# EAGLE design Grove - 3-Axis Digital Compass v1.2 (EAGLE 6.3)
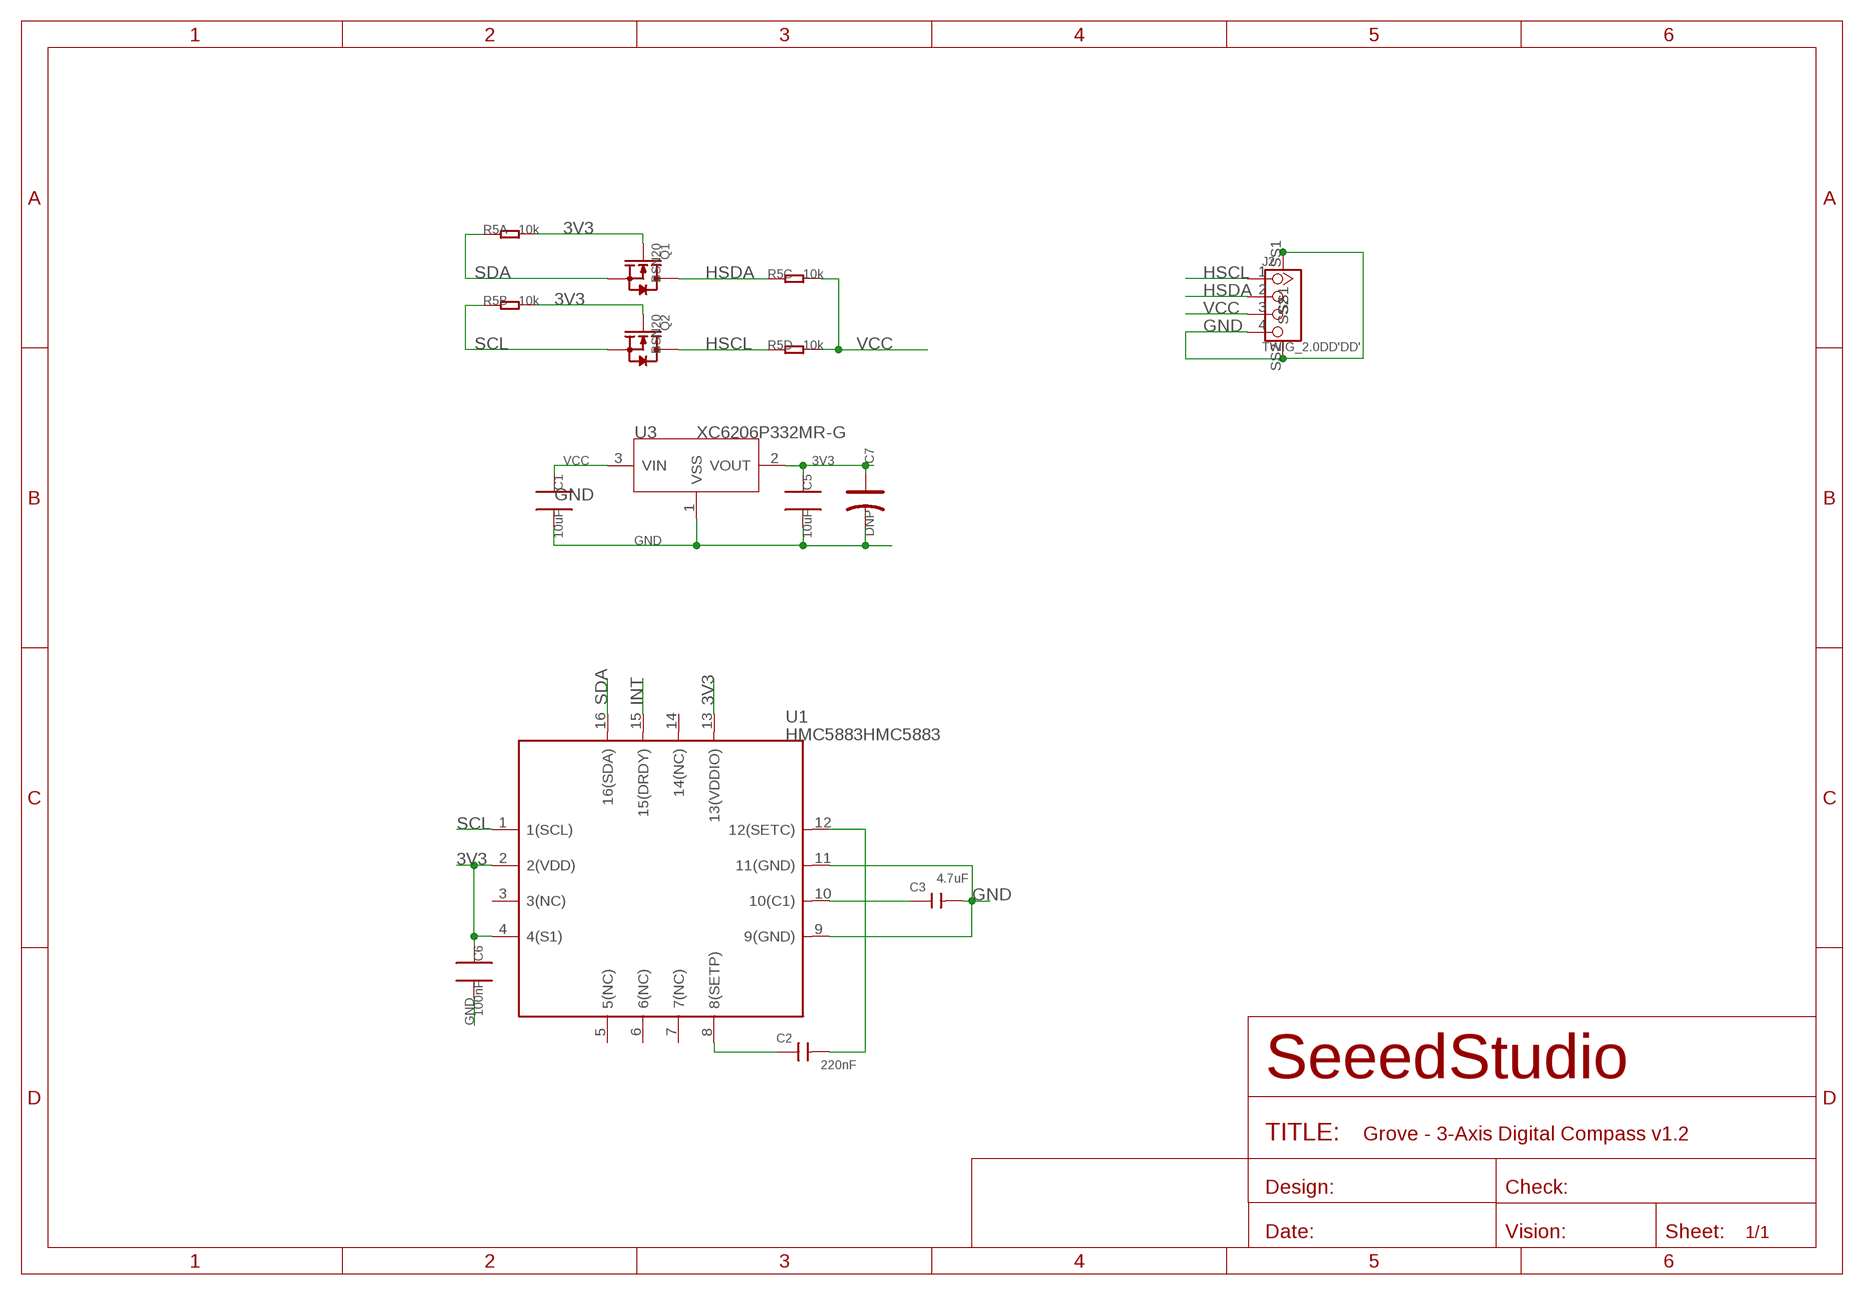
[diagram p0: schematic, sheet 1]

## Parts
C1  10uF  C0805_S  [0805_S]
C2  220nF  006-C30*35  [0603_S]
C3  4.7uF  C-0805  [C0805]
C5  10uF  C0805_S  [0805_S]
C6  100nF  C0603_S  [0603_S]
C7  DNP  CAP-AVX-A  [AVX-A]
J2  TWIG_2.0DD'DD'  [2.0_1X4DD]
Q1  BSN20  MOSFET-N'SOT23'  [SOT23]
Q2  BSN20  MOSFET-N'SOT23'  [SOT23]
R5  10k  005-4R_1206  [R1206-8]
U1  HMC5883HMC5883  [HMC5883]
U3  XC6206P332MR-G  XC6206MR  [SOT23]

## Nets
3V3: C5.1 C6.1 C7.+ Q1.1(G) Q2.1(G) R5.7 R5.8 U1.2(2(VDD)) U1.4(4(S1)) U1.13(13(VDDIO)) U3.2(VOUT)
GND: C1.2 C3.2 C5.2 C6.2 C7.- J2.4 J2.SS1 J2.SS2 U1.9(9(GND)) U1.11(11(GND)) U3.1(VSS)
HSCL: J2.1 Q2.3(D) R5.4
HSDA: J2.2 Q1.3(D) R5.3
INT: U1.15(15(DRDY))
N$1: C2.1 U1.8(8(SETP))
N$2: C2.2 U1.12(12(SETC))
N$4: C3.1 U1.10(10(C1))
SCL: Q2.2(S) R5.2 U1.1(1(SCL))
SDA: Q1.2(S) R5.1 U1.16(16(SDA))
VCC: C1.1 J2.3 R5.5 R5.6 U3.3(VIN)
Unconnected: U1.3(3(NC)) U1.5(5(NC)) U1.6(6(NC)) U1.7(7(NC)) U1.14(14(NC))

## Library data of the parts
C1 C5 = CPT_SMD:C0805
C2 = Discrete:006-C*: Ceramic Capacitors
C3 = Discrete:C*: Ceramic Capacitors
C6 = CPT_SMD:C0603
C7 = Discrete:CAP*: Electrolytic Capacitors,Tantalum Capacitors and Super Capacitors
J2 = CONNECTER:TWIG_2.0DD
Q1 Q2 = Discrete:MOSFET-N: IRLL014: http://www.vishay.com/docs/91319/sihll014.pdf
R5 = Discrete:005-4R*: Resistor Array
U1 = sensor:HMC5883
U3 = IC:XC6206: LOW ESR Cap.Compatible Positive Voltage Regulators

## Net classes
0 default: width 0.152 mm, drill 0.152 mm, clearance 0.152 mm

## Board
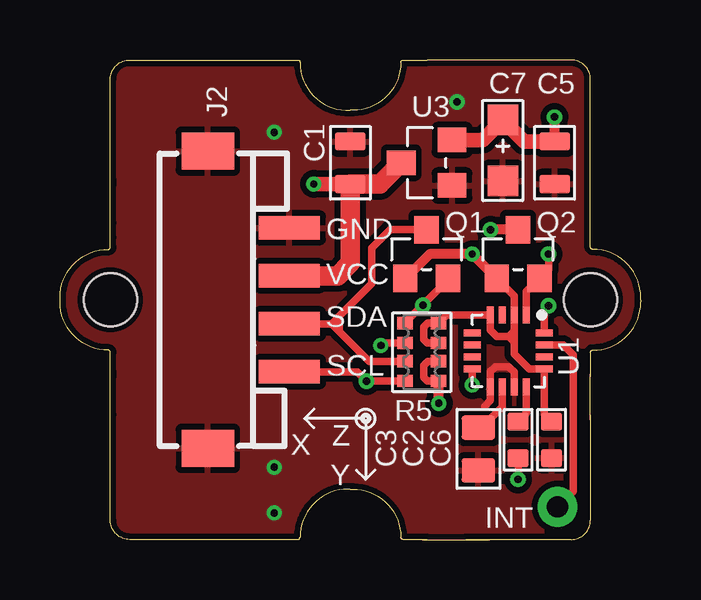
[diagram p1: board, top side]
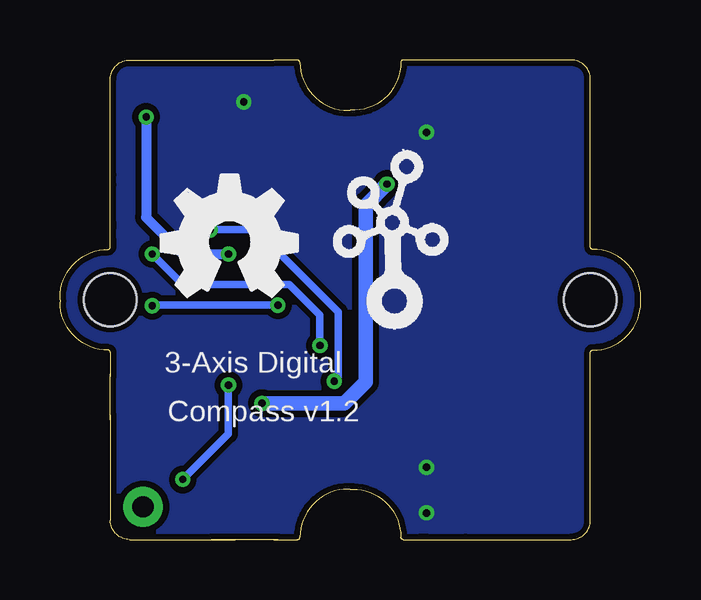
[diagram p2: board, bottom side, seen from below]

Size 24.2 x 20 mm. Coordinates in mm from the lower left corner, seen from the top.
Copper layers (1*16): Top 0.035mm / dielectric 1.5mm / Bottom 0.035mm
Design rules "SeeedStudio_rule_no_angle_090911": minimum track width 6mil, minimum drill 12mil, track to track 6mil, track to pad 6mil, pad to pad 6mil, via to via 6mil, smd to smd 0mil, copper to edge 10mil, drill to drill 10mil, minimum pad ring 10mil, minimum via ring 6mil, stop-mask expansion 2mil, vias tented up to drill 25mil, thermal gap 10mil

### Footprints (pad centres in the part's own frame; a part is rotated, then mirrored left to right if it is on the bottom)
0805_S = smd 0.762 x 1.27: 1 -0.889,0; 2 0.889,0
0603_S = smd 0.762 x 0.889: 1 -0.762,0; 2 0.762,0
C0805 = smd 1.016 x 1.397: 1 -0.889,0; 2 0.889,0
AVX-A = smd 1.27 x 1.27: + -1.27,0; - 1.27,0
2.0_1X4DD = smd 0.965 x 2.54: 1 -3,0; 2 -1,0; 3 1,0; 4 3,0 | smd 1.55 x 2.184: SS1 -6.2,3.4; SS2 6.2,3.4
SOT23 = smd 1.016 x 1.143: 1 -0.889,-1.016; 2 0.889,-1.016; 3 0,1.016
R1206-8 = smd 0.508 x 0.635: 1 -1.206,-0.699; 2 -0.381,-0.699; 3 0.381,-0.699; 4 1.206,-0.699; 5 1.206,0.699; 6 0.381,0.699; 7 -0.381,0.699; 8 -1.206,0.699
HMC5883 = smd 0.7 x 0.3: 1 0,2.25; 2 0,1.75; 3 0,1.25; 4 0,0.75; 9 3,0.75; 10 3,1.25; 11 3,1.75; 12 3,2.25 | smd 0.3 x 0.7: 5 0.75,0; 6 1.25,0; 7 1.75,0; 8 2.25,0; 13 2.25,3; 14 1.75,3; 15 1.25,3; 16 0.75,3
SOT23' = smd 1.016 x 1.2: 1 -0.95,-1.06; 2 0.95,-1.06; 3 0,1.06
1U-DIM-W/-DRILL = hole 2.2: 0,-10; 0,10

### Placement (x,y rotation side)
C1  12.1,15.71 90 top
C2  19.09,4.16 90 top
C3  17.43,3.78 270 top
C5  20.61,15.71 270 top
C6  20.48,4.16 270 top
C7  18.45,16.22 270 top
J2  9.56,10 90 top
Q1  15.27,11.9 0 top
Q2  19.09,11.9 0 top
R5  15.07,7.82 270 top
U1  17.18,9.36 270 top
U3  XC6206P332MR-G  [SOT23']  15.27,15.71 90 top
U$2  [1U-DIM-W/-DRILL]  12.1,10 90 top
U$4  [OSHW_FILLX200_NOTEXT]  19.97,10.13 0 bottom
U$5  [TWIGLOGO]  10.32,9.75 0 bottom

### Tracks (layer width: path | path; a pad name or v marks a point on that pad's centre or on a via)
3V3  (via drill 0.3 pad 0.64)
  Top 0.305: 18.93,8.7 U1.2 18.93,10.15 Q2.1 | 18.93,8.7 18.93,8.48 | 18.93,8.48 18.93,8.25 | 18.7,8.48 18.2,8.48 17.93,8.74 U1.4 16.11,9.36 R5.8 15.31,9.02 15.15,8.86 15.15,8.35 15.3,8.2 R5.7 | 18.7,8.48 18.93,8.48 | 18.93,8.7 18.7,8.48 | 18.93,8.25 18.7,8.48 | C6.1 20.18,5.22 U1.13 19.56,7.11 18.93,7.74 18.93,8.25
  Top 0.406: C5.1 v20.61,17.62 | Q2.1 v17.18,11.9 15.4,11.9 Q1.1
  Top 0.61: U3.2 17.62,16.66 C7.+ 19.34,16.6 C5.1
  Bottom 0.406: v20.61,17.62 20.61,13.43 19.09,11.9 v17.18,11.9
GND  (via drill 0.3 pad 0.64)
  Top 0.305: 17.69,5.55 17.93,5.8 U1.9 17.93,7 18.13,7.21 18.7,7.21 18.93,6.98 U1.11
  other vias: 8.92,1.11 16.54,18.25 8.92,16.98 8.92,3.02
  pour Bottom (isolate 0.254): -0.09,-0.29 24.29,-0.29 24.29,20.16 -0.09,20.16 -0.09,-0.16
  pour Top (isolate 0.254): -0.09,-0.29 24.29,-0.29 24.29,20.16 -0.09,20.16 -0.09,-0.16
HSCL  (via drill 0.3 pad 0.64)
  Top 0.305: R5.4 v12.77,6.61 12.38,7 J2.1
  Top 0.406: Q2.3 v17.94,12.92
  Bottom 0.305: v17.94,12.92 16.04,12.92 12.61,9.49 12.61,6.77 v12.77,6.61 12.73,6.65
HSDA
  Top 0.305: Q1.3 13.75,12.92 12.99,12.16 12.99,10.67 11.64,9.32 | J2.2 11.32,9 | 11.32,9 11.64,8.68 | R5.3 12.89,7.43 11.72,8.6 11.64,8.68 | 11.64,9.32 11.32,9 | 11.64,9.32 11.64,8.68
INT  (via drill 0.89 pad 1.65)
  Top 0.305: v20.74,1.36 21.39,2.02 21.39,7.69 21.18,7.9 21.12,7.97 20.97,8.11 U1.15
N$1  (via drill 0.3 pad 0.64)
  Top 0.305: U1.8 v17.18,6.44 | v19.09,2.51 C2.1
  Bottom 0.305: v17.18,6.44 17.18,4.41 v19.09,2.51
N$2
  Top 0.305: U1.12 19.43,5.27 C2.2
N$4
  Top 0.305: U1.10 18.43,5.53 17.69,4.79 17.56,4.79 C3.1
SCL  (via drill 0.3 pad 0.64)
  Top 0.305: U1.1 19.43,10.34 Q2.2 20.35,11.27 v20.35,11.9 | R5.2 13.47,8.2 v13.37,8.09
  Bottom 0.305: v13.37,8.09 13.37,9.36 14.64,10.63 19.09,10.63 v20.35,11.9
SDA  (via drill 0.3 pad 0.64)
  Top 0.305: Q1.2 16.16,10.81 v15.12,9.77 R5.1 | U1.16 20.18,9.57 v20.35,9.75
  Bottom 0.305: v15.12,9.77 20.33,9.77 v20.35,9.75
VCC  (via drill 0.3 pad 0.64)
  Top 0.305: R5.5 15.3,6.61 15.15,6.76 15.15,7.27 15.31,7.43 R5.6
  Top 0.406: R5.5 15.77,5.67 v15.78,5.68
  Top 0.61: C1.1 v10.58,14.83
  Top 0.813: U3.3 13.33,14.83 C1.1 12.1,11.52 11.58,11 J2.3
  Bottom 0.61: v10.58,14.83 11.46,13.94 11.46,6.57 12.35,5.68 v15.78,5.68

### Text on the board
tPlace: GND | VCC | SDA | SCL | Z | X | Y | INT
bPlace: 3-Axis Digital | Compass v1.2